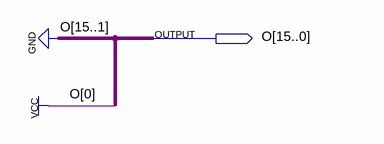
[diagram p0: schematic sheet]
// Quartus schematic Constant1_16.bdf as structural Verilog: 0 symbols, 1 pins
module Constant1_16 (
  output [15:0] O
);


  assign O = 16'b0000000000000001;
endmodule
